# EAGLE design riser-extender-switch (EAGLE 7.7.0)
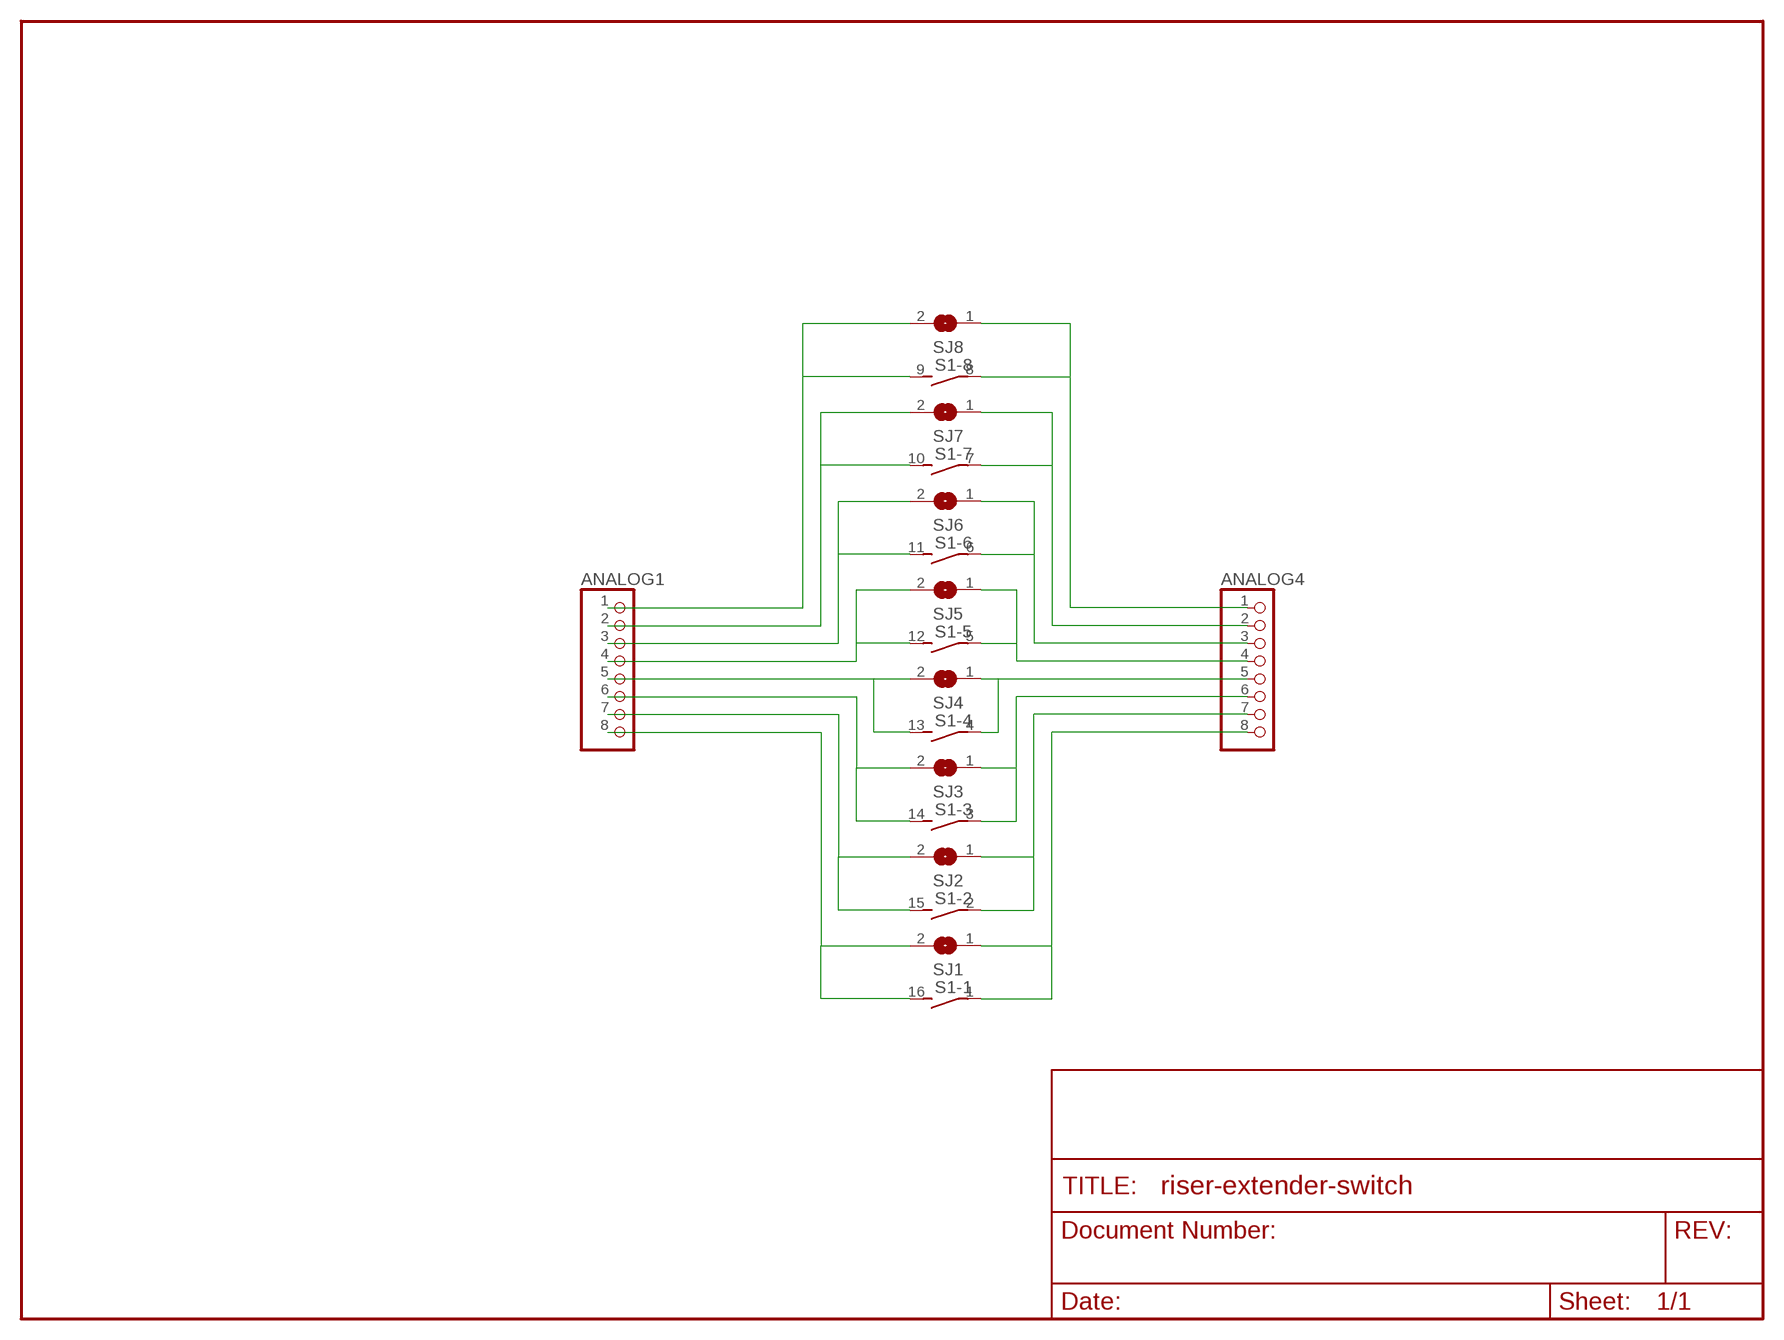
[diagram p0: schematic, sheet 1]

## Parts
ANALOG1  PINHD-1X8  [1X08]
ANALOG4  PINHD-1X8  [1X08]
S1  DIP08S  [DIP08S]
SJ1  SJ  [SJ]
SJ2  SJ  [SJ]
SJ3  SJ  [SJ]
SJ4  SJ  [SJ]
SJ5  SJ  [SJ]
SJ6  SJ  [SJ]
SJ7  SJ  [SJ]
SJ8  SJ  [SJ]

## Nets
N$1: ANALOG1.1 S1.9 SJ8.2
N$2: ANALOG1.2 S1.10 SJ7.2
N$3: ANALOG1.3 S1.11 SJ6.2
N$4: ANALOG1.4 S1.12 SJ5.2
N$5: ANALOG1.5 S1.13 SJ4.2
N$6: ANALOG1.6 S1.14 SJ3.2
N$7: ANALOG1.7 S1.15 SJ2.2
N$8: ANALOG1.8 S1.16 SJ1.2
N$9: ANALOG4.5 S1.4 SJ4.1
N$10: ANALOG4.6 S1.3 SJ3.1
N$11: ANALOG4.7 S1.2 SJ2.1
N$12: ANALOG4.8 S1.1 SJ1.1
N$13: ANALOG4.4 S1.5 SJ5.1
N$14: ANALOG4.3 S1.6 SJ6.1
N$15: ANALOG4.2 S1.7 SJ7.1
N$16: ANALOG4.1 S1.8 SJ8.1

## Library data of the parts
ANALOG1 ANALOG4 = pinhead:PINHD-1X8: PIN HEADER
S1 = switch-dil:DIP08S: DIL/CODE SWITCH; OC_FARNELL: unknown; OC_NEWARK: unknown
SJ1-SJ8 = jumper:SJ: SMD solder JUMPER

## Board
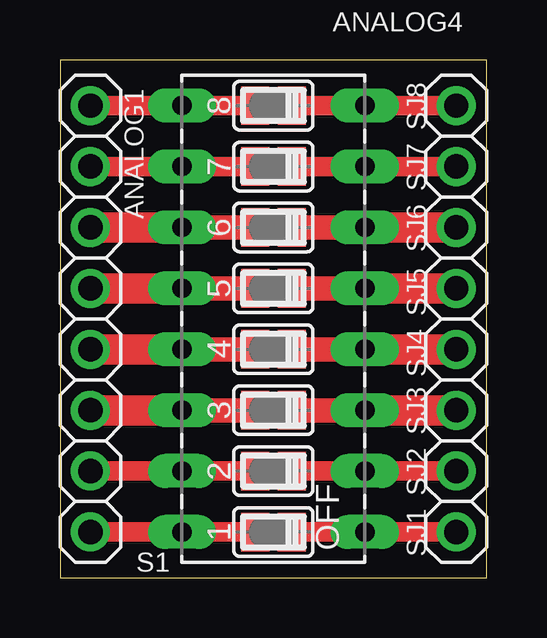
[diagram p1: board, top side]
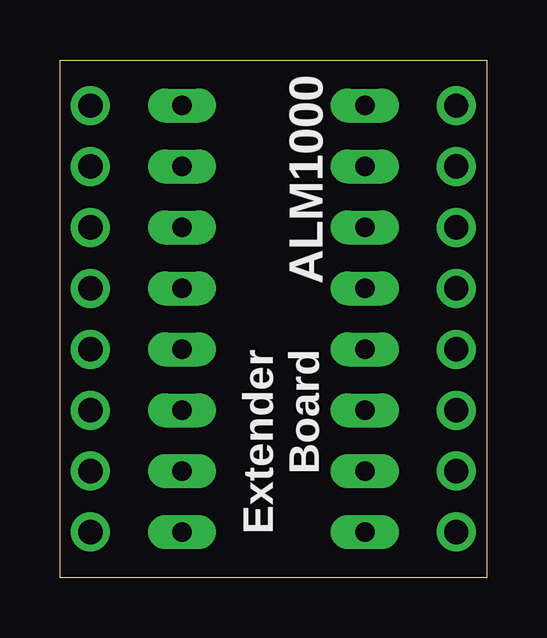
[diagram p2: board, bottom side, seen from below]

Size 17.78 x 21.59 mm. Coordinates in mm from the lower left corner, seen from the top.
Outline: 17.78,0 17.78,21.59 0,21.59 0,0 17.78,0
Copper layers (1*16): Top 0.035mm / dielectric 1.5mm / Bottom 0.035mm
Design rules "default": minimum track width 8mil, minimum drill 20mil, track to track 8mil, track to pad 8mil, pad to pad 8mil, via to via 8mil, smd to smd 8mil, copper to edge 8mil, drill to drill 8mil, minimum pad ring 12mil, minimum via ring 10mil, stop-mask expansion 4mil, vias tented up to drill 20mil, thermal gap 10mil

### Footprints (pad centres in the part's own frame; a part is rotated, then mirrored left to right if it is on the bottom)
1X08 = drill 1.016: 1 -8.89,0; 2 -6.35,0; 3 -3.81,0; 4 -1.27,0; 5 1.27,0; 6 3.81,0; 7 6.35,0; 8 8.89,0
DIP08S = drill 0.813 long: 1 -8.89,-3.81; 2 -6.35,-3.81; 3 -3.81,-3.81; 4 -1.27,-3.81; 5 1.27,-3.81; 6 3.81,-3.81; 7 6.35,-3.81; 8 8.89,-3.81; 9 8.89,3.81; 10 6.35,3.81; 11 3.81,3.81; 12 1.27,3.81; 13 -1.27,3.81; 14 -3.81,3.81; 15 -6.35,3.81; 16 -8.89,3.81
SJ = smd 1.168 x 1.6: 1 -0.762,0; 2 0.762,0

### Placement (x,y rotation side)
ANALOG1  1.27,10.79 270 top
ANALOG4  16.51,10.79 270 top
S1  8.89,10.79 90 top
SJ1  8.89,1.91 180 top
SJ2  8.89,4.45 180 top
SJ3  8.89,6.99 180 top
SJ4  8.89,9.53 180 top
SJ5  8.89,12.06 180 top
SJ6  8.89,14.61 180 top
SJ7  8.89,17.14 180 top
SJ8  8.89,19.68 180 top

### Tracks (layer width: path | path; a pad name or v marks a point on that pad's centre or on a via)
N$1
  Top 0.813: ANALOG1.1 S1.9 SJ8.2
N$2
  Top 0.813: ANALOG1.2 S1.10 SJ7.2
N$3
  Top 1.016: SJ6.2 S1.11
  Top 1.27: ANALOG1.3 S1.11
N$4
  Top 1.016: SJ5.2 S1.12
  Top 1.27: ANALOG1.4 S1.12
N$5
  Top 1.016: S1.13 SJ4.2
  Top 1.27: ANALOG1.5 S1.13
N$6
  Top 1.016: SJ3.2 S1.14
  Top 1.27: ANALOG1.6 S1.14
N$7
  Top 0.813: ANALOG1.7 S1.15 SJ2.2
N$8
  Top 0.813: ANALOG1.8 S1.16 SJ1.2
N$9
  Top 1.016: SJ4.1 S1.4
  Top 1.27: ANALOG4.5 S1.4
N$10
  Top 1.016: S1.3 SJ3.1
  Top 1.27: ANALOG4.6 S1.3
N$11
  Top 0.813: SJ2.1 S1.2 ANALOG4.7
N$12
  Top 0.813: ANALOG4.8 S1.1 SJ1.1
N$13
  Top 1.016: SJ5.1 S1.5
  Top 1.27: ANALOG4.4 S1.5
N$14
  Top 1.016: SJ6.1 S1.6
  Top 1.27: ANALOG4.3 S1.6
N$15
  Top 0.813: ANALOG4.2 S1.7 SJ7.1
N$16
  Top 0.813: ANALOG4.1 S1.8 SJ8.1

### Text on the board
bPlace: ALM1000 | Extender / Board